# EAGLE design niveau (EAGLE 8.5.2)
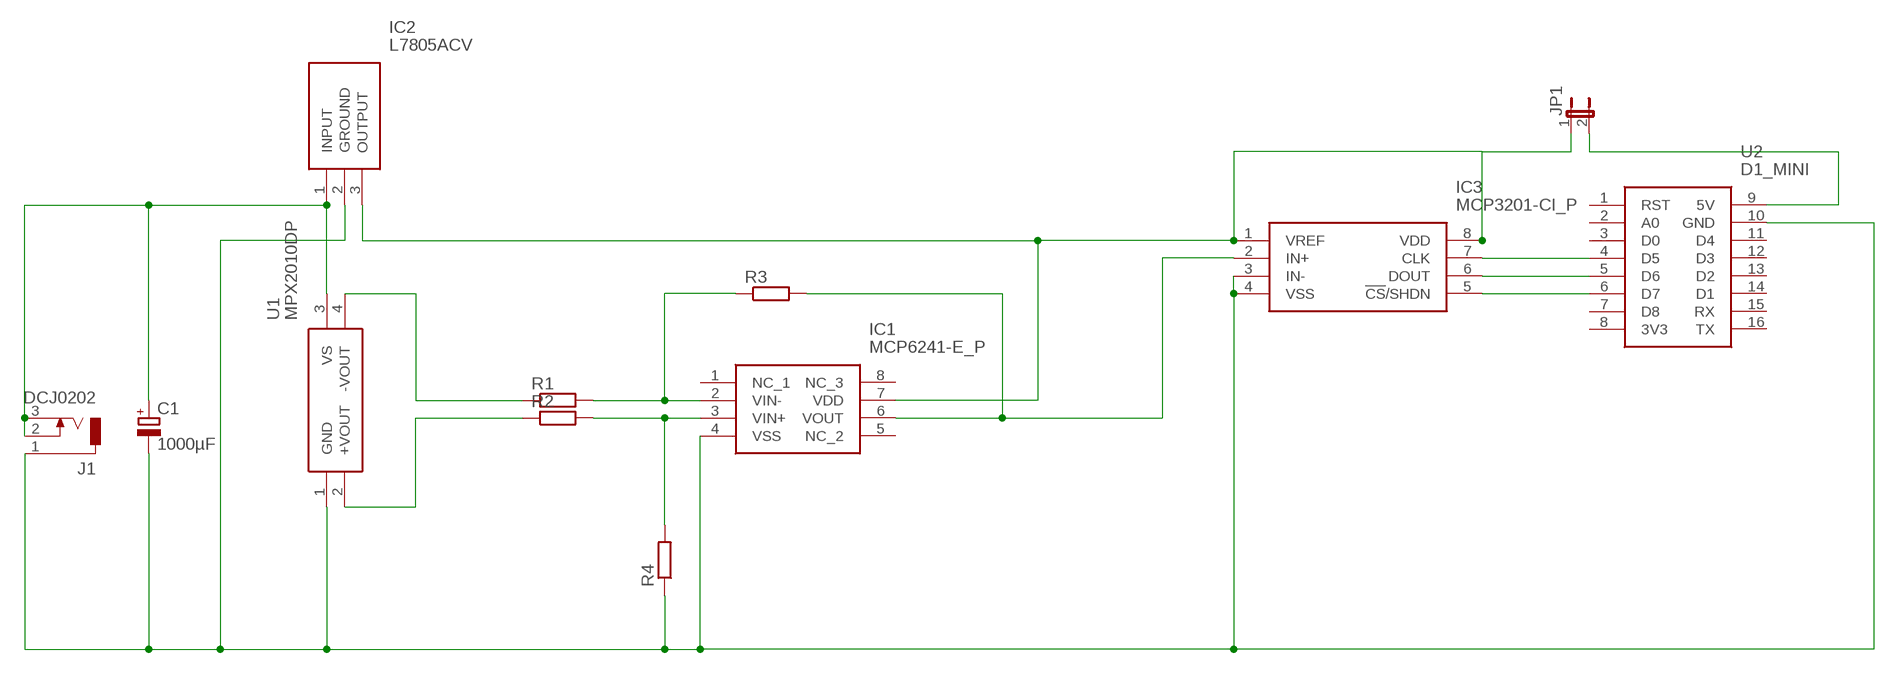
[diagram p0: schematic, sheet 1]

## Parts
C1  1000µF  CPOL-EUE10-35  [EB35D]
IC1  MCP6241-E_P  [DIP781W56P254L950H533Q8N]
IC2  L7805ACV  [TO270P460X1020X2008-3P]
IC3  MCP3201-CI_P  [DIP781W56P254L950H533Q8N]
J1  DCJ0202  [DCJ0202]
JP1  JP1E  [JP1]
R1  R-EU_0309/10  [0309/10]
R2  R-EU_0309/10  [0309/10]
R3  R-EU_0309/10  [0309/10]
R4  R-EU_0309/10  [0309/10]
U1  MPX2010DP  [CASE-344C-01-ISSUE-B]
U2  D1_MINI  [D1-MINI]

## Nets
N$1: R1.1 U1.4(-VOUT)
N$2: R2.1 U1.2(+VOUT)
N$3: C1.- IC1.4(VSS) IC2.2(GROUND) IC3.3(IN-) IC3.4(VSS) J1.1 R4.1 U1.1(GND) U2.10(GND)
N$4: C1.+ IC2.1(INPUT) J1.2 J1.3 U1.3(VS)
N$5: IC1.6(VOUT) IC3.2(IN+) R3.2
N$6: IC1.7(VDD) IC2.3(OUTPUT) IC3.1(VREF) IC3.8(VDD) JP1.1
N$7: IC1.2(VIN-) R1.2 R3.1
N$8: JP1.2 U2.9(5V)
N$9: IC3.7(CLK) U2.4(D5)
N$10: IC3.6(DOUT) U2.5(D6)
N$11: IC3.5(!CS!/SHDN) U2.6(D7)
N$12: IC1.3(VIN+) R2.2 R4.2
Unconnected: IC1.1(NC_1) IC1.5(NC_2) IC1.8(NC_3) U2.1(RST) U2.2(A0) U2.3(D0) U2.7(D8) U2.8(3V3) U2.11(D4) U2.12(D3) U2.13(D2) U2.14(D1) U2.15(RX) U2.16(TX)

## Library data of the parts
C1 = rcl:CPOL-EU: POLARIZED CAPACITOR, European symbol; SPICEPREFIX: C
IC1 = MCP6241-E_P:MCP6241-E_P: Microchip MCP6241-E/P, Op Amp, RRIO, 550kHz, 3 V, 5 V, 8-Pin PDIP Source: Datasheet <http://ww1.microchip.com/downloads/en/DeviceDoc/21882d.pdf>; ALLIED_NUMBER: 70048230; ALLIED_PRICE/STOCK: https://www.alliedelec.com/microchip-technology-inc-mcp6241-e-p/70048230/; ARROW_PART_NUMBER: MCP6241-E/P; ARROW_PRICE/STOCK: https://www.arrow.com/en/products/mcp6241-ep/microchip-technology; DESCRIPTION: Microchip MCP6241-E/P, Op Amp, RRIO, 550kHz, 3 V, 5 V, 8-Pin PDIP; HEIGHT: 5.334mm; MANUFACTURER_NAME: Microchip; MANUFACTURER_PART_NUMBER: MCP6241-E/P; RS_PART_NUMBER: 0403018; RS_PRICE/STOCK: http://uk.rs-online.com/web/p/products/0403018
IC2 = L7805ACV:L7805ACV: Linear voltage regulator,L7805ACV 5V 1A STMicroelectronics L7805ACV, Single Linear Voltage Regulator, 1A 5 V, 2%, 3-Pin TO-220 Source: Datasheet <http://www.st.com/web/en/resource/technical/document/datasheet/CD00000444.pdf>; ALLIED_NUMBER: 70013701; ALLIED_PRICE/STOCK: http://www.alliedelec.com/stmicroelectronics-l7805acv/70013701/; ARROW_PART_NUMBER: L7805ACV; ARROW_PRICE/STOCK: https://www.arrow.com/en/products/l7805acv/stmicroelectronics; DESCRIPTION: Linear voltage regulator,L7805ACV 5V 1A STMicroelectronics L7805ACV, Single Linear Voltage Regulator, 1A 5 V, 2%, 3-Pin TO-220; HEIGHT: 4.6mm; MANUFACTURER_NAME: STMicroelectronics; MANUFACTURER_PART_NUMBER: L7805ACV; RS_PART_NUMBER: 1686059; RS_PRICE/STOCK: http://uk.rs-online.com/web/p/products/1686059
IC3 = MCP3201-CI_P:MCP3201-CI_P: Microchip MCP3201-CI/P, 12 bit Serial ADC, Differential Input, 8-Pin PDIP Source: Datasheet <http://uk.rs-online.com/web/p/products/3792386>; ARROW_PART_NUMBER: MCP3201-CI/P; ARROW_PRICE/STOCK: https://www.arrow.com/en/products/mcp3201-cip/microchip-technology; DESCRIPTION: Microchip MCP3201-CI/P, 12 bit Serial ADC, Differential Input, 8-Pin PDIP; HEIGHT: 5.334mm; MANUFACTURER_NAME: Microchip; MANUFACTURER_PART_NUMBER: MCP3201-CI/P; RS_PART_NUMBER: 8895770; RS_PRICE/STOCK: http://uk.rs-online.com/web/p/products/8895770
J1 = con-jack:DCJ0202: DC POWER JACK Source: DCJ0202.pdf; OC_FARNELL: unknown; OC_NEWARK: unknown
JP1 = jumper:JP1E: JUMPER
R1-R4 = rcl:R-EU_: RESISTOR, European symbol; SPICEPREFIX: R
U1 = MPX2010DP:MPX2010DP: Pressure Sensor 10kPa Differential 2Port Pressure Sensor 10kPa Differential 2Port Source: Datasheet <http://www.nxp.com/assets/documents/data/en/data-sheets/MPX2010.pdf>; ARROW_PART_NUMBER: MPX2010DP; ARROW_PRICE/STOCK: https://www.arrow.com/en/products/mpx2010dp/nxp-semiconductors; DESCRIPTION: Pressure Sensor 10kPa Differential 2Port Pressure Sensor 10kPa Differential 2Port; HEIGHT: mm; MANUFACTURER_NAME: Nexperia; MANUFACTURER_PART_NUMBER: MPX2010DP; RS_PART_NUMBER: 7191021; RS_PRICE/STOCK: http://uk.rs-online.com/web/p/products/7191021
U2 = D1_Mini:D1_MINI: wifi board based on ESP-8266EX. Source: Datasheet <https://www.wemos.cc/product/d1-mini.html>; ARROW_PART_NUMBER: D1 Mini; DESCRIPTION: wifi board based on ESP-8266EX.; HEIGHT: mm; MANUFACTURER_NAME: Wemos; MANUFACTURER_PART_NUMBER: D1 Mini

## Board
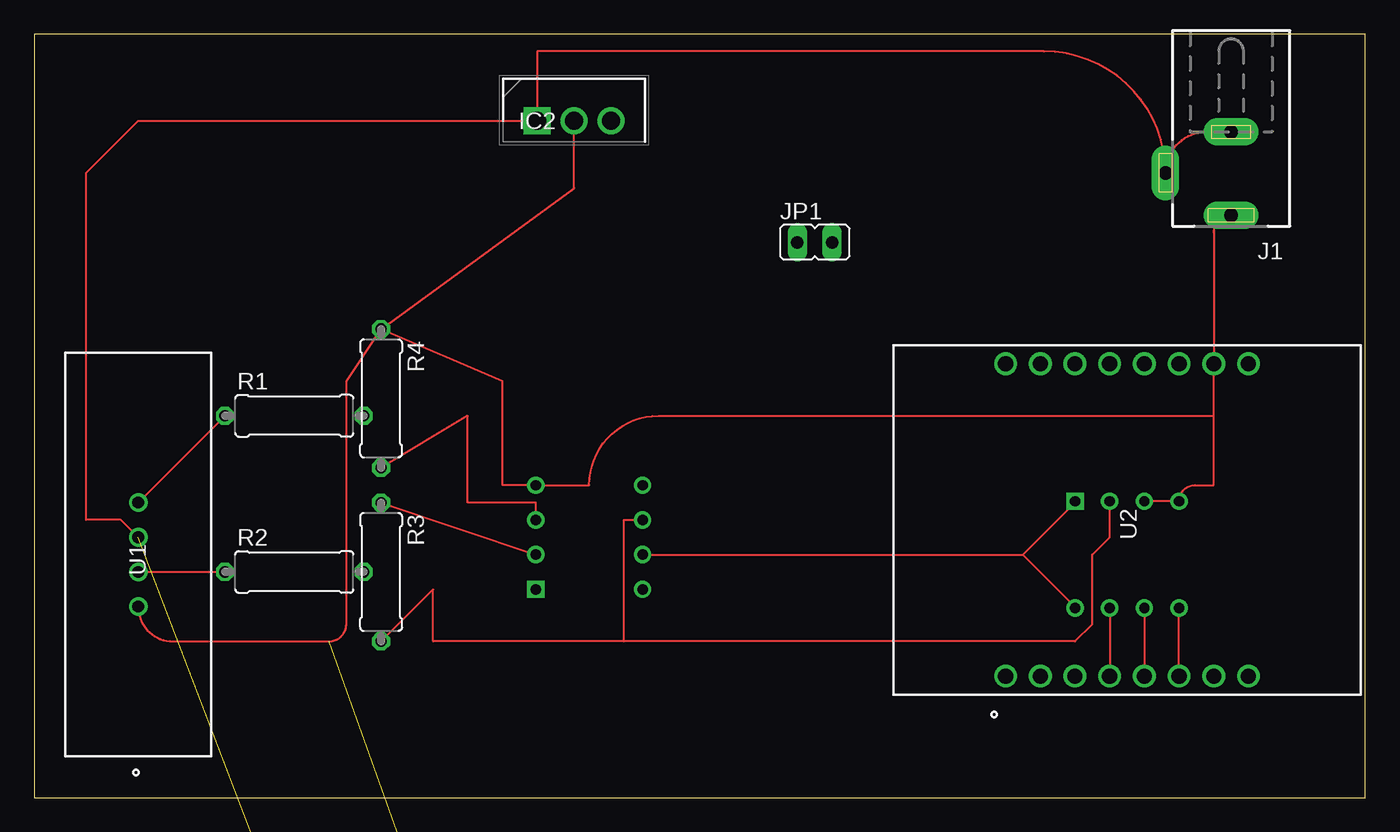
[diagram p1: board, top side]
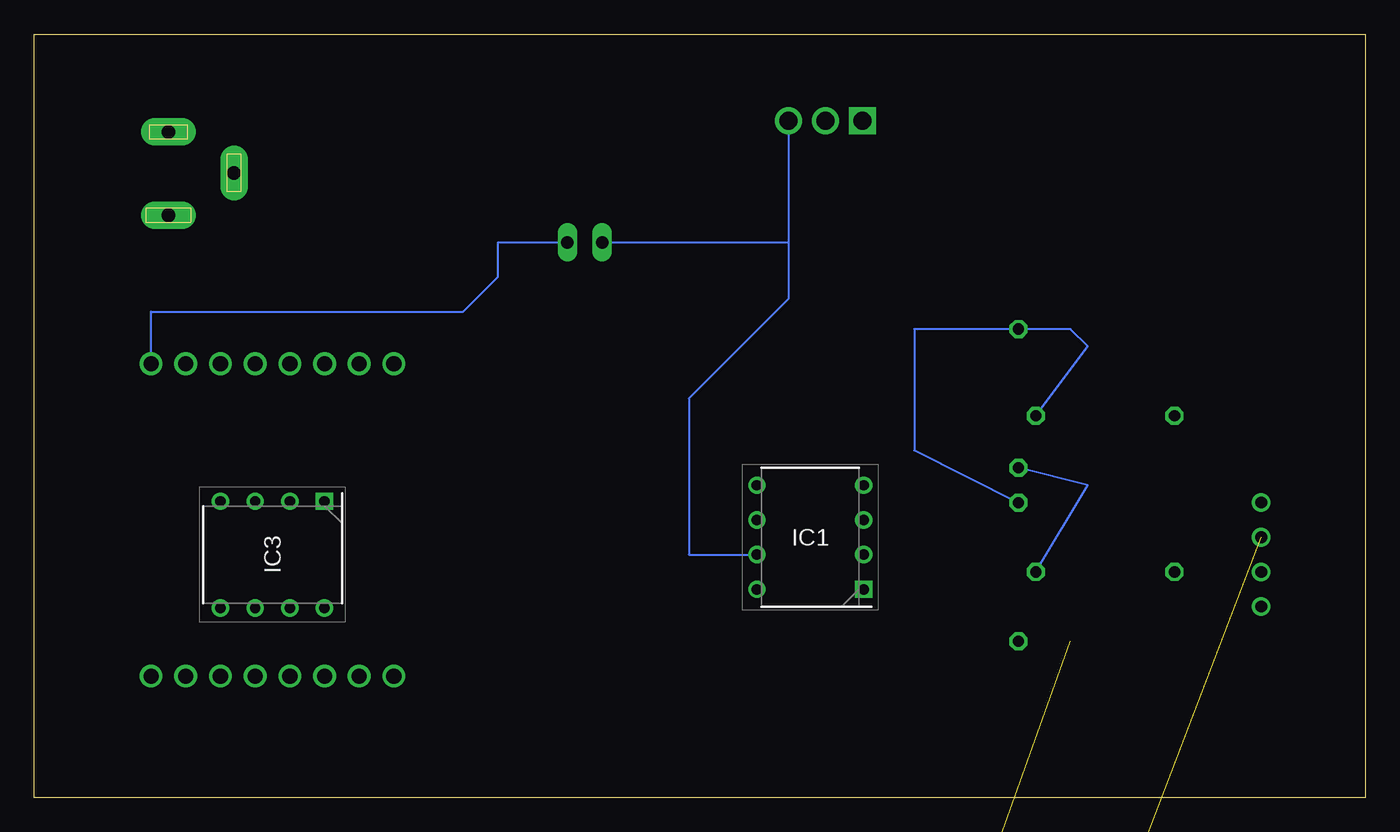
[diagram p2: board, bottom side, seen from below]

Size 97.46 x 55.87 mm. Coordinates in mm from the lower left corner, seen from the top.
Outline: 0,0 97.46,0 97.46,55.87 0,55.87 0,0
Copper layers (1*16): Top 0.035mm / dielectric 1.5mm / Bottom 0.035mm
Design rules "default": minimum track width 6mil, minimum drill 0.35mm, track to track 6mil, track to pad 6mil, pad to pad 6mil, via to via 6mil, smd to smd 6mil, copper to edge 40mil, drill to drill 6mil, minimum pad ring 10mil, minimum via ring 8mil, stop-mask expansion 4mil, vias tented up to drill 0mil, thermal gap 10mil

### Footprints (pad centres in the part's own frame; a part is rotated, then mirrored left to right if it is on the bottom)
EB35D = drill 2.007 pad 4.597: + -5.08,0 | drill 2.007 pad 4.597 octagon: - 5.08,0
DIP781W56P254L950H533Q8N = drill 0.759 pad 1.159 square: 1 -3.905,3.81 | drill 0.759 pad 1.159: 2 -3.905,1.27; 3 -3.905,-1.27; 4 -3.905,-3.81; 5 3.905,-3.81; 6 3.905,-1.27; 7 3.905,1.27; 8 3.905,3.81
TO270P460X1020X2008-3P = drill 1.32 pad 1.98 square: 1 0,0 | drill 1.32 pad 1.98: 2 2.7,0; 3 5.4,0
DCJ0202 = drill 1 pad 2 long: 1 0,3.1; 2 4.8,0; 3 0,-3
JP1 = drill 0.914 long: 1 0,-1.27; 2 0,1.27
0309/10 = drill 0.813 octagon: 1 -5.08,0; 2 5.08,0
CASE-344C-01-ISSUE-B = drill 0.85 pad 1.35: 1 -3.81,0; 2 -1.27,0; 3 1.27,0; 4 3.81,0
D1-MINI = drill 1.11 pad 1.61: 1 -11.43,8.89; 2 -11.43,6.35; 3 -11.43,3.81; 4 -11.43,1.27; 5 -11.43,-1.27; 6 -11.43,-3.81; 7 -11.43,-6.35; 8 -11.43,-8.89; 9 11.43,-8.89; 10 11.43,-6.35; 11 11.43,-3.81; 12 11.43,-1.27; 13 11.43,1.27; 14 11.43,3.81; 15 11.43,6.35; 16 11.43,8.89

### Placement (x,y rotation side)
C1  29.21,-24.13 0 top  (outside the outline)
IC1  40.64,19.05 180 bottom
IC2  36.83,49.53 0 top
IC3  80.01,17.78 270 bottom
J1  87.63,45.72 180 top
JP1  57.15,40.64 270 top
R1  19.05,27.94 0 top
R2  19.05,16.51 0 top
R3  25.4,16.51 270 top
R4  25.4,29.21 270 top
U1  7.62,17.78 90 top
U2  80.01,20.32 90 top

### Tracks (layer width: path | path; a pad name or v marks a point on that pad's centre or on a via)
N$1
  Top 0.152: U1.4 R1.1
N$2
  Top 0.152: U1.2 R2.1
N$3  (1 unrouted)
  Top 0.152: R4.1 39.53,44.61 IC2.2 | 58.42,27.94 86.36,27.94 | 86.36,27.94 U2.10 86.36,41.35 arc-90 J1.1 | IC3.3 IC3.4 arc-90 84.99,22.86 86.36,22.86 86.36,27.94 | U1.1 arc90 10.16,11.43 21.59,11.43 arc90 22.86,12.7 22.86,30.48 R4.1 | IC1.4 36.83,22.86 | 36.83,22.86 40.64,22.86 arc-90 45.72,27.94 86.36,27.94 | IC1.4 36.83,22.86 | IC1.4 35.56,22.86 | 35.56,22.86 | 35.56,22.86 34.29,22.86 34.29,30.48 R4.1
N$4  (1 unrouted)
  Top 0.152: U1.3 6.35,20.32 3.81,20.32 3.81,45.72 7.62,49.53 IC2.1 36.83,54.61 73.94,54.61 arc-90 J1.2 arc-90 85.83,48.72 J1.3
N$5
  Top 0.152: IC3.2 78.74,19.05 77.47,17.78 77.47,12.7 76.2,11.43 43.18,11.43 | 43.18,11.43 43.18,20.32 IC1.6 | R3.2 29.21,15.24 29.21,11.43 43.18,11.43
N$6
  Top 0.152: IC3.1 76.2,21.59 72.39,17.78 | IC1.7 72.39,17.78 | 72.39,17.78 76.2,13.97 IC3.8
  Bottom 0.152: IC2.3 42.23,40.64 | 42.23,40.64 42.23,36.51 49.53,29.21 49.53,17.78 IC1.7 | JP1.1 42.23,40.64
N$7
  Top 0.152: R3.1 IC1.2
  Bottom 0.152: R1.2 20.32,33.02 21.59,34.29 33.02,34.29 33.02,25.4 R3.1
N$8
  Bottom 0.152: U2.9 88.9,35.56 66.04,35.56 63.5,38.1 63.5,40.64 JP1.2
N$9
  Top 0.152: IC3.7 U2.4
N$10
  Top 0.152: IC3.6 U2.5
N$11
  Top 0.152: U2.6 IC3.5
N$12
  Top 0.152: IC1.3 36.73,21.59 31.75,21.59 31.75,27.94 R4.2
  Bottom 0.152: R2.2 20.32,22.86 R4.2